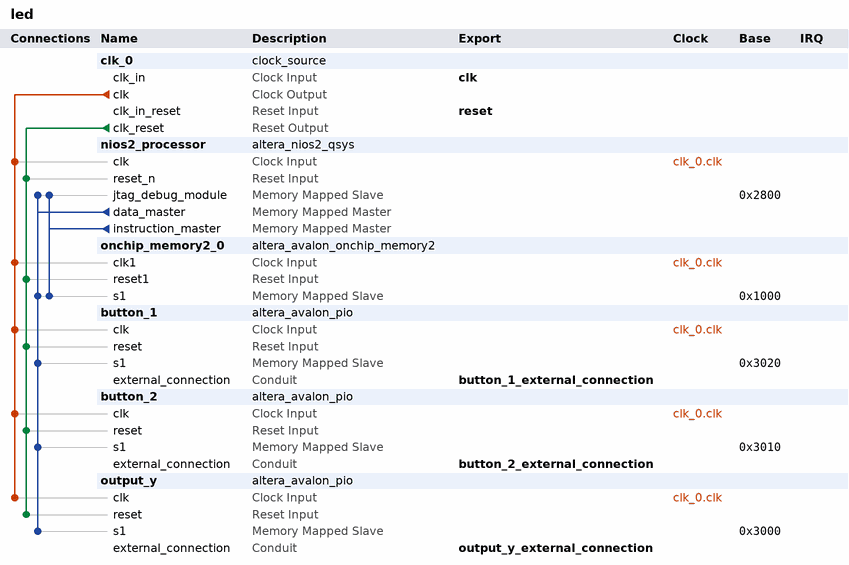
[diagram p0: system contents]
# Platform Designer (Qsys) system led, Cyclone IV GX EP4CGX15BF14A7
# Parameters at their usual value, and those the tool derives, are not listed.
package require -exact qsys 13.1
create_system led
set_project_property DEVICE_FAMILY {Cyclone IV GX}
set_project_property DEVICE EP4CGX15BF14A7

add_instance clk_0 clock_source 13.1
set_instance_parameter_value clk_0 clockFrequency 50000000

add_instance nios2_processor altera_nios2_qsys 13.1
set_instance_parameter_value nios2_processor resetSlave onchip_memory2_0.s1
set_instance_parameter_value nios2_processor mmu_TLBMissExcSlave None
set_instance_parameter_value nios2_processor exceptionSlave onchip_memory2_0.s1
set_instance_parameter_value nios2_processor breakSlave nios2_processor.jtag_debug_module
set_instance_parameter_value nios2_processor impl Tiny
set_instance_parameter_value nios2_processor icache_size 4096

add_instance onchip_memory2_0 altera_avalon_onchip_memory2 13.1
set_instance_parameter_value onchip_memory2_0 dataWidth 32
set_instance_parameter_value onchip_memory2_0 dualPort false
set_instance_parameter_value onchip_memory2_0 initMemContent true
set_instance_parameter_value onchip_memory2_0 initializationFileName onchip_mem.hex
set_instance_parameter_value onchip_memory2_0 memorySize 4096

add_instance button_1 altera_avalon_pio 13.1
set_instance_parameter_value button_1 direction Input
set_instance_parameter_value button_1 width 2

add_instance button_2 altera_avalon_pio 13.1
set_instance_parameter_value button_2 direction Input
set_instance_parameter_value button_2 width 2

add_instance output_y altera_avalon_pio 13.1
set_instance_parameter_value output_y direction Output
set_instance_parameter_value output_y width 3

# connections
add_connection clk_0.clk button_1.clk clock
add_connection clk_0.clk button_2.clk clock
add_connection clk_0.clk nios2_processor.clk clock
add_connection clk_0.clk onchip_memory2_0.clk1 clock
add_connection clk_0.clk output_y.clk clock
add_connection clk_0.clk_reset button_1.reset reset
add_connection clk_0.clk_reset button_2.reset reset
add_connection clk_0.clk_reset nios2_processor.reset_n reset
add_connection clk_0.clk_reset onchip_memory2_0.reset1 reset
add_connection clk_0.clk_reset output_y.reset reset
add_connection nios2_processor.data_master button_1.s1 avalon
set_connection_parameter_value nios2_processor.data_master/button_1.s1 baseAddress 0x3020
add_connection nios2_processor.data_master button_2.s1 avalon
set_connection_parameter_value nios2_processor.data_master/button_2.s1 baseAddress 0x3010
add_connection nios2_processor.data_master nios2_processor.jtag_debug_module avalon
set_connection_parameter_value nios2_processor.data_master/nios2_processor.jtag_debug_module baseAddress 0x2800
add_connection nios2_processor.data_master onchip_memory2_0.s1 avalon
set_connection_parameter_value nios2_processor.data_master/onchip_memory2_0.s1 baseAddress 0x1000
add_connection nios2_processor.data_master output_y.s1 avalon
set_connection_parameter_value nios2_processor.data_master/output_y.s1 baseAddress 0x3000
add_connection nios2_processor.instruction_master nios2_processor.jtag_debug_module avalon
set_connection_parameter_value nios2_processor.instruction_master/nios2_processor.jtag_debug_module baseAddress 0x2800
add_connection nios2_processor.instruction_master onchip_memory2_0.s1 avalon
set_connection_parameter_value nios2_processor.instruction_master/onchip_memory2_0.s1 baseAddress 0x1000

# exported interfaces
add_interface clk clock sink
set_interface_property clk EXPORT_OF clk_0.clk_in
add_interface reset reset sink
set_interface_property reset EXPORT_OF clk_0.clk_in_reset
add_interface button_2_external_connection conduit end
set_interface_property button_2_external_connection EXPORT_OF button_2.external_connection
add_interface output_y_external_connection conduit end
set_interface_property output_y_external_connection EXPORT_OF output_y.external_connection
add_interface button_1_external_connection conduit end
set_interface_property button_1_external_connection EXPORT_OF button_1.external_connection

set_interconnect_requirement {$system} qsys_mm.clockCrossingAdapter HANDSHAKE
set_interconnect_requirement {$system} qsys_mm.maxAdditionalLatency 1
set_interconnect_requirement {$system} qsys_mm.insertDefaultSlave false

save_system led.qsys
